# Altium schematic sheet USB-Serial.SchDoc: USB-Serial
size Letter; SheetNumber: 4; SheetTotal: 12
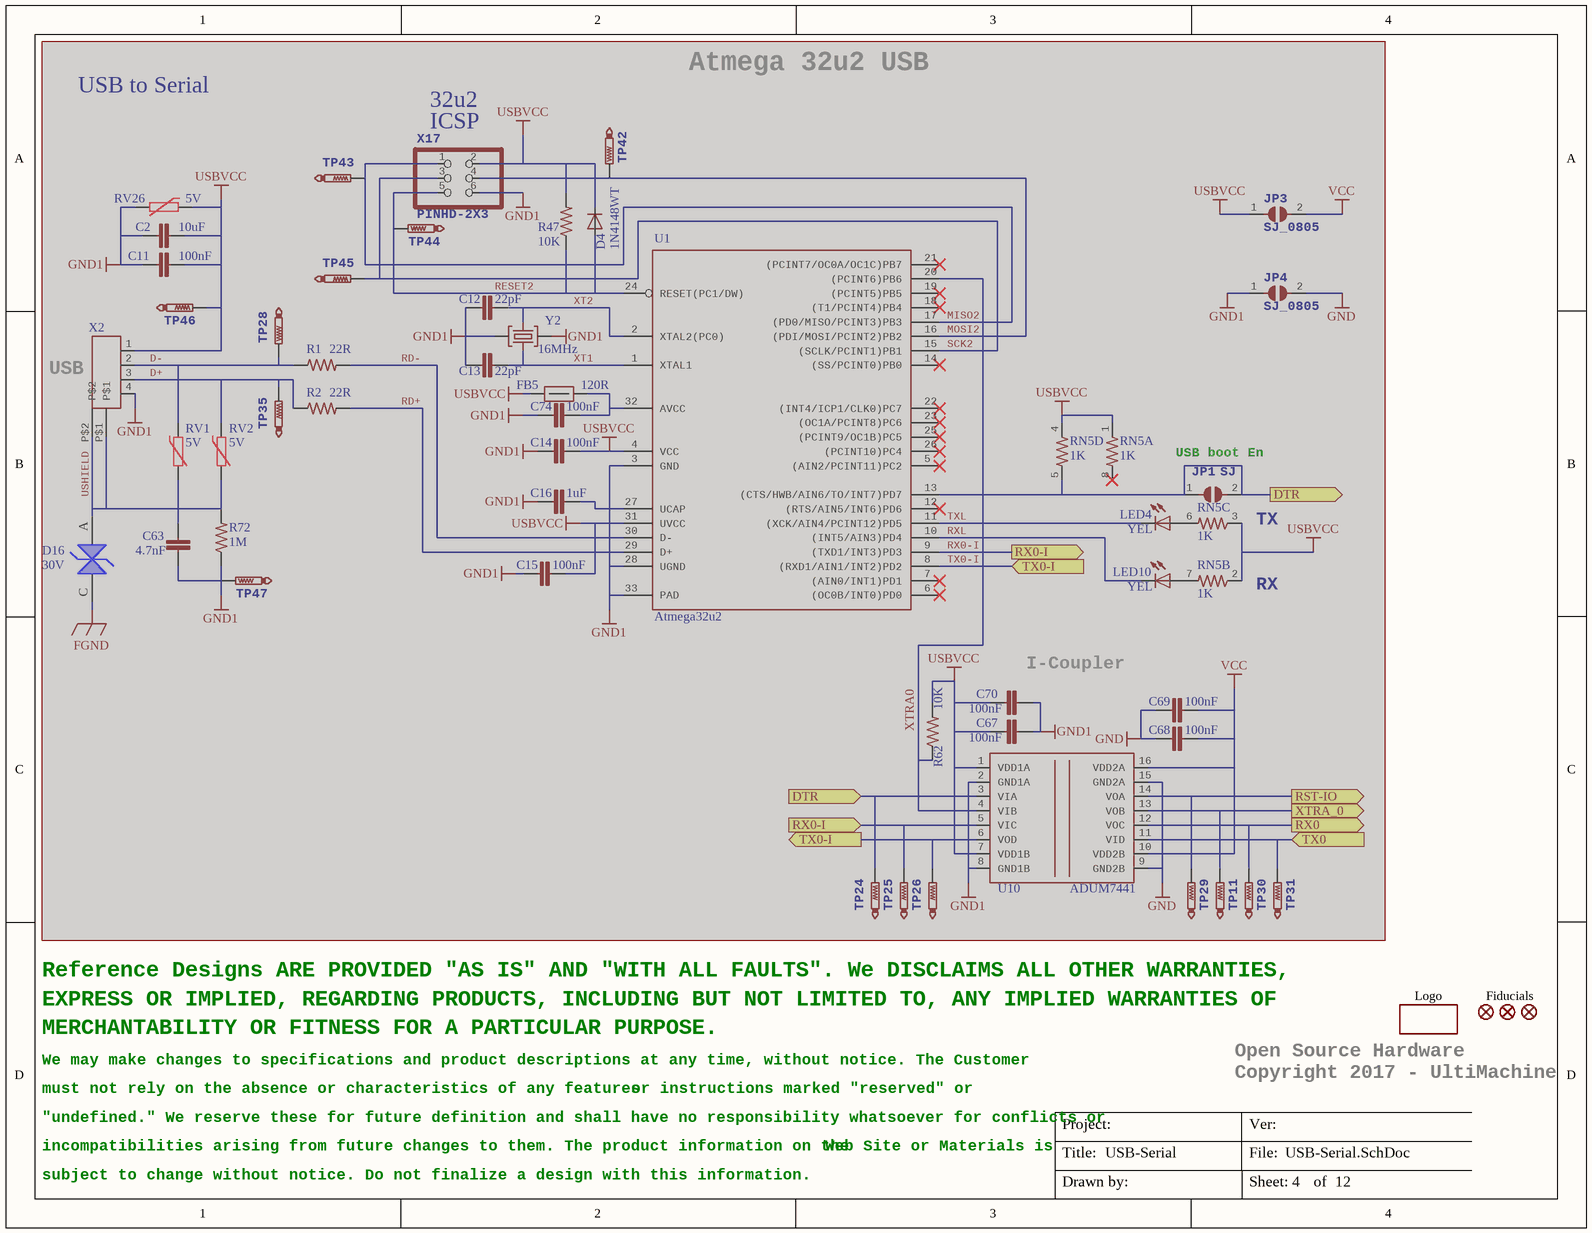
[diagram p0: USB-Serial.SchDoc]

## Parts
C2  10uF  [C0805]  (masked out: inside a compile mask, not in the netlist)
C11  100nF  [C0402]  (masked out: inside a compile mask, not in the netlist)
C12  22pF  [C0402]  (masked out: inside a compile mask, not in the netlist)
C13  22pF  [C0402]  (masked out: inside a compile mask, not in the netlist)
C14  100nF  [C0402]  (masked out: inside a compile mask, not in the netlist)
C15  100nF  [C0402]  (masked out: inside a compile mask, not in the netlist)
C16  1uF  [C0402]  (masked out: inside a compile mask, not in the netlist)
C63  4.7nF  [C0402]  (masked out: inside a compile mask, not in the netlist)
C67  100nF  [C0402]  (masked out: inside a compile mask, not in the netlist)
C68  100nF  [C0402]  (masked out: inside a compile mask, not in the netlist)
C69  100nF  [C0402]  (masked out: inside a compile mask, not in the netlist)
C70  100nF  [C0402]  (masked out: inside a compile mask, not in the netlist)
C74  100nF  [C0402]  (masked out: inside a compile mask, not in the netlist)
D4  1N4148WT  [SOD523]  (masked out: inside a compile mask, not in the netlist)
D16  value 30V  [SOD323-R]  (hidden comment: RSB39VTE-17)  (masked out: inside a compile mask, not in the netlist)
FB5  120R  [FB0603]  (masked out: inside a compile mask, not in the netlist)
FID1  FIDUCIAL  [FIDUCIAL-1X2]  (value not drawn)
FID2  FIDUCIAL  [FIDUCIAL-1X2]  (value not drawn)
FID3  FIDUCIAL  [FIDUCIAL-1X2]  (value not drawn)
JP1  SJ  [SJ]  (no BOM)  (masked out: inside a compile mask, not in the netlist)
JP3  SJ_0805  [R0805]  (masked out: inside a compile mask, not in the netlist)
JP4  SJ_0805  [R0805]  (masked out: inside a compile mask, not in the netlist)
LED4  YEL  [LED2012120]  (masked out: inside a compile mask, not in the netlist)
LED10  YEL  [LED2012120]  (masked out: inside a compile mask, not in the netlist)
LOGO1  OSHW_LOGO_8MILX0150-NT  [OSHW_8X150_NOTEXT]  (value not drawn)  (no BOM)
R1  22R  [R0402]  (masked out: inside a compile mask, not in the netlist)
R2  22R  [R0402]  (masked out: inside a compile mask, not in the netlist)
R47  10K  [R0402]  (masked out: inside a compile mask, not in the netlist)
R62  10K  [R0402]  (masked out: inside a compile mask, not in the netlist)
R72  1M  [R0402]  (masked out: inside a compile mask, not in the netlist)
RN5  1K  [CAY16]  (parts A,B,C,D of 4)  (masked out: inside a compile mask, not in the netlist)
RV1  value 5V  [R0603]  (hidden comment: CG0603MLC-05E)  (masked out: inside a compile mask, not in the netlist)
RV2  value 5V  [R0603]  (hidden comment: CG0603MLC-05E)  (masked out: inside a compile mask, not in the netlist)
RV26  value 5V  [R0603]  (hidden comment: CG0603MLC-05E)  (masked out: inside a compile mask, not in the netlist)
TP11  TestPoint  [TP1-27]  (value not drawn)  (no BOM)  (masked out: inside a compile mask, not in the netlist)
TP24  TestPoint  [TP1-27]  (value not drawn)  (no BOM)  (masked out: inside a compile mask, not in the netlist)
TP25  TestPoint  [TP1-27]  (value not drawn)  (no BOM)  (masked out: inside a compile mask, not in the netlist)
TP26  TestPoint  [TP1-27]  (value not drawn)  (no BOM)  (masked out: inside a compile mask, not in the netlist)
TP28  TestPoint  [TP1-27]  (value not drawn)  (no BOM)  (masked out: inside a compile mask, not in the netlist)
TP29  TestPoint  [TP1-27]  (value not drawn)  (no BOM)  (masked out: inside a compile mask, not in the netlist)
TP30  TestPoint  [TP1-27]  (value not drawn)  (no BOM)  (masked out: inside a compile mask, not in the netlist)
TP31  TestPoint  [TP1-27]  (value not drawn)  (no BOM)  (masked out: inside a compile mask, not in the netlist)
TP35  TestPoint  [TP1-27]  (value not drawn)  (no BOM)  (masked out: inside a compile mask, not in the netlist)
TP42  TestPoint  [TP1-27]  (value not drawn)  (no BOM)  (masked out: inside a compile mask, not in the netlist)
TP43  TestPoint  [TP1-27]  (value not drawn)  (no BOM)  (masked out: inside a compile mask, not in the netlist)
TP44  TestPoint  [TP1-27]  (value not drawn)  (no BOM)  (masked out: inside a compile mask, not in the netlist)
TP45  TestPoint  [TP1-27]  (value not drawn)  (no BOM)  (masked out: inside a compile mask, not in the netlist)
TP46  TestPoint  [TP1-27]  (value not drawn)  (no BOM)  (masked out: inside a compile mask, not in the netlist)
TP47  TestPoint  [TP1-27]  (value not drawn)  (no BOM)  (masked out: inside a compile mask, not in the netlist)
U1  Atmega32u2  [QFN32_050050]  (masked out: inside a compile mask, not in the netlist)
U10  ADUM7441  [QSOP16]  (masked out: inside a compile mask, not in the netlist)
X2  USB-B  [PN61729]  (value not drawn)  (masked out: inside a compile mask, not in the netlist)
X17  PINHD-2X3  [2X03]  (masked out: inside a compile mask, not in the netlist)
Y2  value 16MHz  [CRYS320250]  (hidden comment: 7M-16.000MEEQ-T)  (masked out: inside a compile mask, not in the netlist)

## Ports
DTR, RST-IO, RX0, RX0-I, TX0, TX0-I, XTRA_0

## Notes on the sheet
- USB to Serial
- (near X17) 32u2
- Atmega 32u2 USB
- (near X17) ICSP
- (near X2) USB
- (near JP1) USB boot En
- TX
- (near RN5) RX
- (near C70) I-Coupler
- Reference Designs ARE PROVIDED "AS IS" AND "WITH ALL FAULTS". We DISCLAIMS ALL OTHER WARRANTIES,
- MERCHANTABILITY OR FITNESS FOR A PARTICULAR PURPOSE.
- EXPRESS OR IMPLIED, REGARDING PRODUCTS, INCLUDING BUT NOT LIMITED TO, ANY IMPLIED WARRANTIES OF
- (near LOGO1) Logo
- Fiducials
- must not rely on the absence or characteristics of any features
- We may make changes to specifications and product descriptions at any time, without notice. The Customer
- or instructions marked "reserved" or
- Copyright 2017 - UltiMachine
- (near LOGO1) Open Source Hardware
- incompatibilities arising from future changes to them. The product information on the
- "undefined." We reserve these for future definition and shall have no responsibility whatsoever for conflicts or
- subject to change without notice. Do not finalize a design with this information.
- Web Site or Materials is
- Title:
- Project:
- File:
- Ver:
- Drawn by:
- Sheet:
- of

## Library data of the parts
C2 = C0805C106K8PACTU: CAP CER 0805 10uF 10V 10% X5R; Manufacturer: Kemet; Part Description: 10µF ±10% 10V Ceramic Capacitor X5R 0805 (2012 Metric); EE_SPEC: 10uF 10V X5R 0805; Tolerance: +/- 10%; VALUE: 10uF; MANUFACTURER #: C0805C106K8PACTU; DISTRIBUTOR #: 399-4925-2-ND; DISTRIBUTOR: Digi-Key; PART: 10uF
C11 C14 C15 C67-C70 C74 = GRM155R71C104KA88D: CAP CER 0402 100nF 16V 10% X7R; Manufacturer: Murata; Part Description: 0.10µF ±10% 16V Ceramic Capacitor X7R 0402 (1005 Metric); EE_SPEC: 100nF 16V X7R 0402; Tolerance: +/- 10%; VALUE: 100nF; MANUFACTURER #: GRM155R71C104KA88D; DISTRIBUTOR #: 490-3261-2-ND; DISTRIBUTOR: Digi-Key; PART: 100nF
C12 C13 = 04025A220JAT2A: CAP CER 0402 22pF 50V 5% C0G; Manufacturer: AVX; Part Description: 22pF ±5% 50V Ceramic Capacitor C0G, NP0 0402 (1005 Metric); EE_SPEC: 22pF 5% 50V NP0 0402; VALUE: 22pF; MANUFACTURER #: 04025A220JAT2A; DISTRIBUTOR #: 478-1074-2-ND; DISTRIBUTOR: Digi-Key; PART: 22pF 50V; Tolerance: 5%
C16 = GRM155R60J105KE19D: CAP CER 0402 1uF 6.3V 10% X5R; Manufacturer: Murata; Part Description: 1µF ±10% 6.3V Ceramic Capacitor X5R 0402 (1005 Metric); EE_SPEC: 1uF 6.3V X5R 0402; Tolerance: +/- 10%; VALUE: 1uF; MANUFACTURER #: GRM155R60J105KE19D; DISTRIBUTOR #: 490-1320-2-ND; DISTRIBUTOR: Digi-Key; PART: 1uF
C63 = CC0402KRX7R8BB472: CAP CER 0402 4.7nF 25V 10% X7R; Manufacturer: YAGEO; Part Description: 4700pF ±10% 25V Ceramic Capacitor X7R 0402 (1005 Metric); EE_SPEC: 4.7nF 25V X7R 0402; Tolerance: +/- 10%; VALUE: 4.7nF; MANUFACTURER #: CC0402KRX7R8BB472; DISTRIBUTOR #: 311-1039-2-ND; DISTRIBUTOR: Digi-Key; PART: 4.7nF
D4 = 1N4148WT: DIODE SOD523; Manufacturer: Fairchild; Part Description: DIODE GEN PURP 75V 200MA SOD523F; EE_SPEC: 75V 0.2A; Tolerance: NA; Value: 1N4148WT; DISTRIBUTOR #: 1N4148WTTR-ND; DISTRIBUTOR: Digi-Key; MANUFACTURER #: 1N4148WT; PART: 1N4148WT
D16 = RSB39VTE-17: DIODE TVS; Manufacturer: Rohm; Part Description: TVS DIODE 30VWM SOD323; EE_SPEC: 30Vrs 35.1Vbd 30pF; Tolerance: NA; MANUFACTURER #: RSB39VTE-17; DISTRIBUTOR #: RSB39VTE-17TR-ND; DISTRIBUTOR: Digi-Key; PART: 30V
FB5 = FERRITE 120R 3A 0603: FERRITE BEAD 120 OHM 0603 1LN; MANUFACTURER: Samsung; MANUFACTURER #: CIS10P121AC; VALUE: 120Rfb; TOLERANCE: -NA-; EE_SPEC: 3A; DISTRIBUTOR #: 1276-6351-2-ND; DISTRIBUTOR: DigiKey; PART: FERRITE 120R 3A 0603; PART DESCRIPTION: FERRITE BEAD 120 OHM 0603 1LN
JP1 = SJ: SMD solder jumper
JP3 JP4 = SJ_0805: SMD solder jumper; LastRevisionNote: ImportComponents; Published: 23-Apr-2014; Publisher: UltiMachine; LastRevisionDate: 23-Apr-2014
LED4 LED10 = 5988140107F: LED 0805 Yellow; Manufacturer: Dialight; Part Description: Yellow 593nm LED Indication - Discrete 2V 0805 (2012 Metric); EE_SPEC: 2V 0.02A; Tolerance: NA; VALUE: YEL; MANUFACTURER #: 5988140107F; DISTRIBUTOR #: 350-2041-2-ND; DISTRIBUTOR: Digi-Key; PART: YEL
R1 R2 = RC0402FR-0722RL: RES 0402 22r 62.5mW 1%; Manufacturer: Yageo; Part Description: 22 Ohm ±1% 0.063W, 1/16W Chip Resistor 0402 (1005 Metric) Moisture Resistant Thick Film; EE_SPEC: 22R 1% 0402; Tolerance: +/- 1%; VALUE: 22R; DISTRIBUTOR #: 311-22.0LRTR-ND; DISTRIBUTOR: Digi-Key; MANUFACTURER #: RC0402FR-0722RL; PART: 22R
R47 R62 = RC0402FR-0710KP: RES SMD 10K OHM 1% 1/16W 0402; MANUFACTURER: Yageo; PART: 10k 1% 0402; PART DESCRIPTION: 10k Ohm ±1% 0.063W, 1/16W Chip Resistor 0402 (1005 Metric) Moisture Resistant Thick Film; EE_SPEC: 10k 1% 0402 1/16W; VALUE: 10K; MANUFACTURER #: RC0402FR-0710KP; DISTRIBUTOR #: YAG1249TR-ND; DISTRIBUTOR: Digi-Key; TOLERANCE: 1%
R72 = ERJ2GEJ105X: RES 0402 1M 100mW 5%; Manufacturer: Panasonic; Part Description: 1M Ohm ±5% 0.1W, 1/10W Chip Resistor 0402 (1005 Metric) Automotive AEC-Q200 Thick Film; EE_SPEC: 1M 1% 0402; Tolerance: +/- 1%; VALUE: 1M; MANUFACTURER #: ERJ2GEJ105X; DISTRIBUTOR #: P1.0MJTR-ND; DISTRIBUTOR: Digi-Key; PART: 1M
RN5 = CAY16-102J4LF: RES ARRAY 4 RES 1K 1206 62.5mW 5%; Manufacturer: Bourns; Part Description: 1k Ohm ±5% 62.5mW Power Per Element Isolated Resistor Network/Array ±200ppm/°C 1206 (3216 Metric), Convex, Long Side Terminals; EE_SPEC: 1k 5% Array_x_4; Tolerance: +/- 5%; VALUE: 1K; MANUFACTURER #: CAY16-102J4LF; DISTRIBUTOR #: CAY16-102J4LFTR-ND; DISTRIBUTOR: Digi-Key; PART: 1K
RV1 RV2 RV26 = CG0603MLC-05E: VAR 0603 5V; Manufacturer: YAGEO; EE_SPEC: 5VDC; Tolerance: NA; MANUFACTURER #: CG0603MLC-05E; DISTRIBUTOR #: CG0603MLC-05ETR-ND; DISTRIBUTOR: Digi-Key; PART: 5VDC; Part Description: VARISTOR 0603
TP11 TP24-TP26 TP28-TP31 TP35 TP42-TP47 = TestPoint: Test Point
U1 = ATMEGA32U2-MU2: Manufacturer: Microchip; MANUFACTURER #: ATMEGA32U2-MUR; Part Description: AVR AVR® ATmega Microcontroller IC 8-Bit 16MHz 32KB (16K x 16) FLASH 32-VQFN (5x5); EE_SPEC: 5V 32KB 1KB; Tolerance: NA; DISTRIBUTOR #: ATMEGA32U2-MURTR-ND; DISTRIBUTOR: Digi-Key; PART: ATMEGA32U2; VALUE: ATMEGA32U2
U10 = ADUM7441: 4ch iCoupler; Manufacturer: Analog Devices; MANUFACTURER #: ADUM7441ARQZ-RL7; PART: ADUM7441ARQZ; Part Description: General Purpose Digital Isolator 1000Vrms 4 Channel 1Mbps 15kV/µs CMTI 16-SSOP (0.154", 3.90mm Width); EE_SPEC: 5V 1000Viso; Tolerance: NA; VALUE: ADUM7441ARQZ; DISTRIBUTOR #: ADUM7441ARQZ-RL7TR-ND; DISTRIBUTOR: Digi-Key
X2 = USB-B: USB connector B PTH; Manufacturer: FCI; MANUFACTURER #: 61729-0010BLF; Part Description: USB - B USB 2.0 Receptacle Connector 4 Position Through Hole, Right Angle; EE_SPEC: USB-B T-Hole R/A; Tolerance: NA; DISTRIBUTOR #: 609-1039-ND; DISTRIBUTOR: Digi-Key; PART: USB-B; VALUE: USB-B
X17 = PINHD-2X3: CONN HEADER VERT 6POS GOLD; Manufacturer: MultiComp; MANUFACTURER #: 2213S-06G; PART: 6PIN; Part Description: 6 Positions Header Connector 0.100" (2.54mm) Through Hole Gold; EE_SPEC: 10Pin 2Row 0.1" T-Hole; Tolerance: NA; VALUE: 6PIN; DISTRIBUTOR #: 08N6789; DISTRIBUTOR: Newark
Y2 = 7M-16.000MEEQ-T: Crystal 16mHz 10ppm 10pF; Manufacturer: TXC; Part Description: CRYSTAL 16.0000MHZ 10PF SMD; EE_SPEC: 10ppm 10pF 80R; MANUFACTURER #: 7M-16.000MEEQ-T; DISTRIBUTOR #: 887-1319-2-ND; DISTRIBUTOR: Digi-Key; PART: 16MHz; Tolerance: 10ppm